# Altium schematic sheet Sheet_4_nizovie.SchDoc
size A4
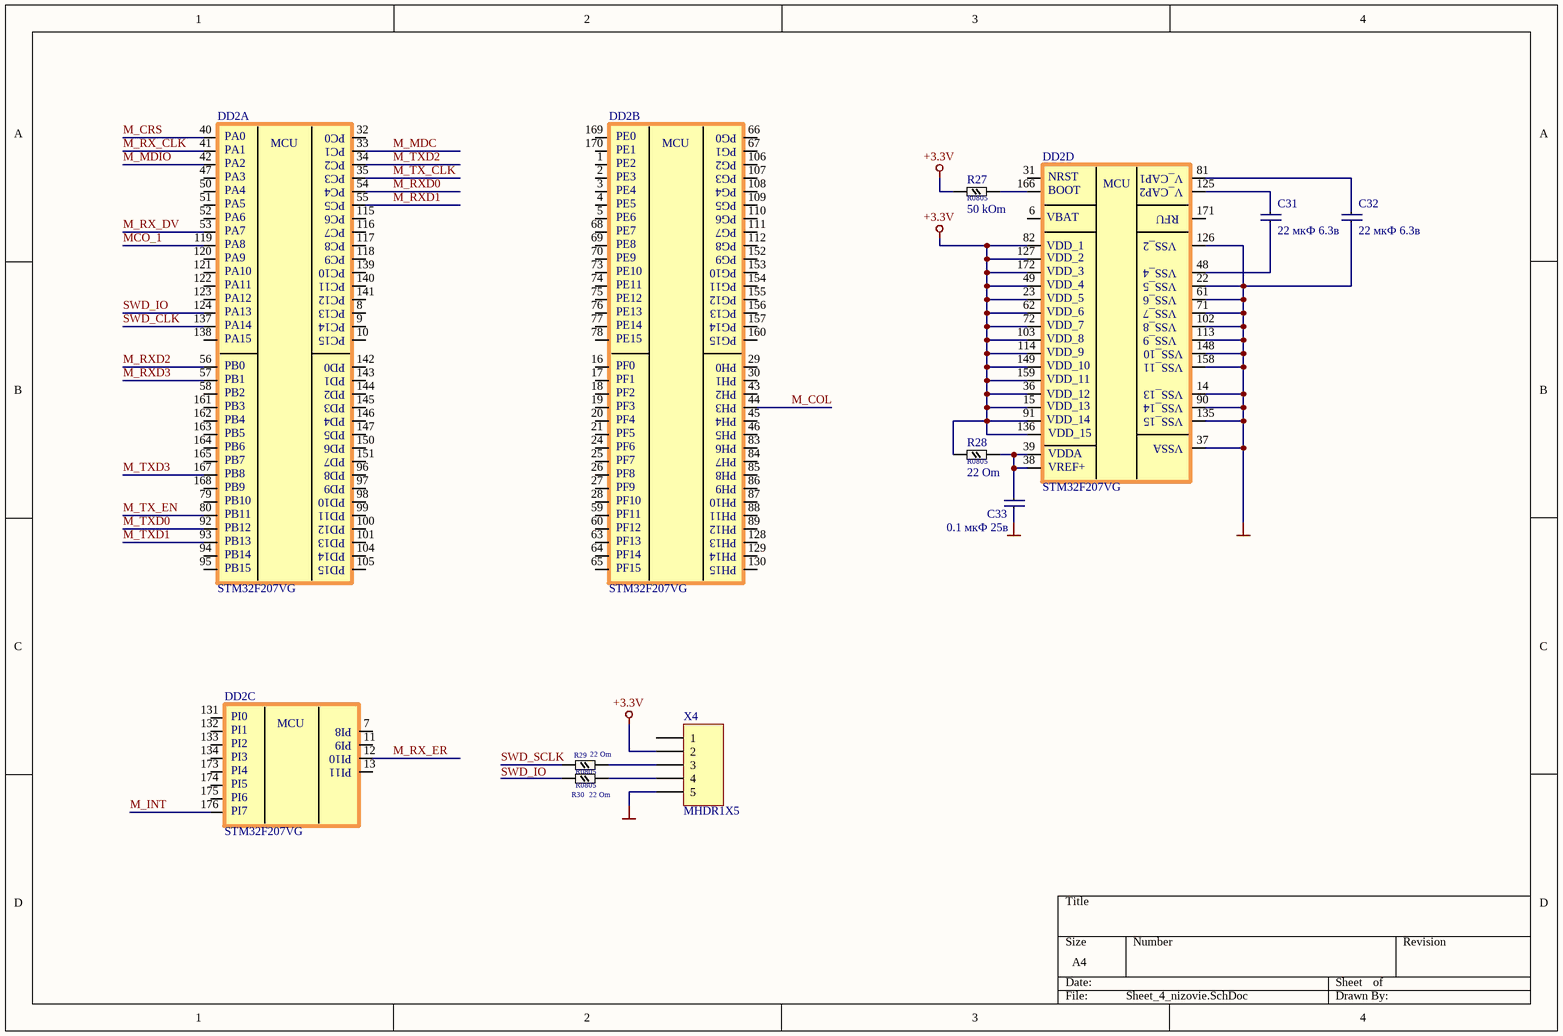
[diagram p0: Sheet_4_nizovie.SchDoc]

## Parts
C31  22 мкФ 6.3в  [FP_0805]
C32  22 мкФ 6.3в  [FP_0805]
C33  0.1 мкФ 25в  [FP_0805]
DD2  STM32F207VG  [TSQFP50P2600X2600X160-176N]  (parts A,B,C,D of 4)
R27  50 kOm  [FP_0805]
R28  22 Om  [FP_0805]
R29  22 Om  [FP_0805]
R30  22 Om  [FP_0805]
X4  MHDR1X5  [MHDR1X5]

## Nets
+3.3V: DD2.15 DD2.23 DD2.36 DD2.49 DD2.62 DD2.72 DD2.82 DD2.91 DD2.103 DD2.114 DD2.127 DD2.136 DD2.149 DD2.159 DD2.172 R27.1 R28.1 X4.2
GND: C32.1 C33.1 DD2.14 DD2.22 DD2.37 DD2.61 DD2.71 DD2.90 DD2.102 DD2.113 DD2.126 DD2.135 DD2.148 DD2.158 X4.5
M_COL: DD2.44
M_CRS: DD2.40
M_INT: DD2.176
M_MDC: DD2.33
M_MDIO: DD2.42
M_RX_CLK: DD2.41
M_RX_DV: DD2.53
M_RX_ER: DD2.12
M_RXD0: DD2.54
M_RXD1: DD2.55
M_RXD2: DD2.56
M_RXD3: DD2.57
M_TX_CLK: DD2.35
M_TX_EN: DD2.80
M_TXD0: DD2.92
M_TXD1: DD2.93
M_TXD2: DD2.34
M_TXD3: DD2.167
MCO_1: DD2.119
SWD_CLK: DD2.137
SWD_IO: DD2.124
SWD_SCLK: R29.1
NetC31_1: C31.1 DD2.48
NetC31_2: C31.2 DD2.125
NetC32_2: C32.2 DD2.81
NetC33_2: C33.2 DD2.38 DD2.39 R28.2
NetDD2_166: DD2.166 R27.2
NetR29_2: R29.2 X4.3
NetR30_2: R30.2 X4.4

Not connected (* = marked no-connect by the designer): DD2 1 2 3 4 5 6 7 8 9 10 11 13 16 17 18 19 20 21 24 25 26 27 28 29 30 31 32 43 45 46 47 50 51 52 58 59 60 63 64 65 66 67 68 69 70 73 74 75 76 77 78 79 83 84 85 86 87 88 89 94 95 96 97 98 99 100 101 104 105 106 107 108 109 110 111 112 115 116 117 118 120 121 122 123 128 129 130 131 132 133 134 138 139 140 141 142 143 144 145 146 147 150 151 152 153 154 155 156 157 160 161 162 163 164 165 168 169 170 171 173 174 175; R30 1; X4 1

## Notes on the sheet
- Labels drawn without touching a wire or pin: SWD_IO
- (in symbol STM32D207VG, part A) PC0; PA0; PC1; MCU; PA1; PC2; PA2; PC3; PA3; PC4; PA4; PC5; PA5; PC6; PA6; PC7; PA7; PC8; PA8; PC9; PA9; PC10; PA10; PC11; PA11; PC12; PA12; PC13; PA13; PC14; PA14; PC15; PA15; PD0; PB0; PD1; PB1; PD2; PB2; PD3; PB3; PD4; PB4; PD5; PB5; PD6; PB6; PD7; PB7; PD8; PB8; PD9; PB9; PD10; PB10; PD11; PB11; PD12; PB12; PD13; PB13; PD14; PB14; PD15; PB15
- (in symbol STM32D207VG, part B) PG0; PE0; PG1; MCU; PE1; PG2; PE2; PG3; PE3; PG4; PE4; PG5; PE5; PG6; PE6; PG7; PE7; PG8; PE8; PG9; PE9; PG10; PE10; PG11; PE11; PG12; PE12; PC13; PE13; PG14; PE14; PG15; PE15; PH0; PF0; PH1; PF1; PH2; PF2; PH3; PF3; PH4; PF4; PH5; PF5; PH6; PF6; PH7; PF7; PH8; PF8; PH9; PF9; PH10; PF10; PH11; PF11; PH12; PF12; PH13; PF13; PH14; PF14; PH15; PF15
- (in symbol STM32D207VG, part C) PI0; PI8; MCU; PI1; PI9; PI2; PI10; PI3; PI11; PI4; PI5; PI6; PI7
- (in symbol STM32D207VG, part D) V_CAP1; NRST; V_CAP2; MCU; BOOT; RFU; VBAT; VSS_2; VDD_1; VDD_2; VSS_4; VDD_3; VSS_5; VDD_4; VSS_6; VDD_5; VSS_7; VDD_6; VSS_8; VDD_7; VSS_9; VDD_8; VSS_10; VDD_9; VSS_11; VDD_10; VDD_11; VSS_13; VDD_12; VSS_14; VDD_13; VSS_15; VDD_14; VDD_15; VSSA; VDDA; VREF+

## Library data of the parts
C31-C33 = C0805
DD2 = STM32D207VG: STM32
R27-R30 = R0805
X4 = MHDR1X5: Header, 5-Pin; LatestRevisionDate: 17-Jul-2002; LatestRevisionNote: Re-released for DXP Platform.; Publisher: Altium Limited